# Altium schematic sheet Sheet1.SchDoc
size A4
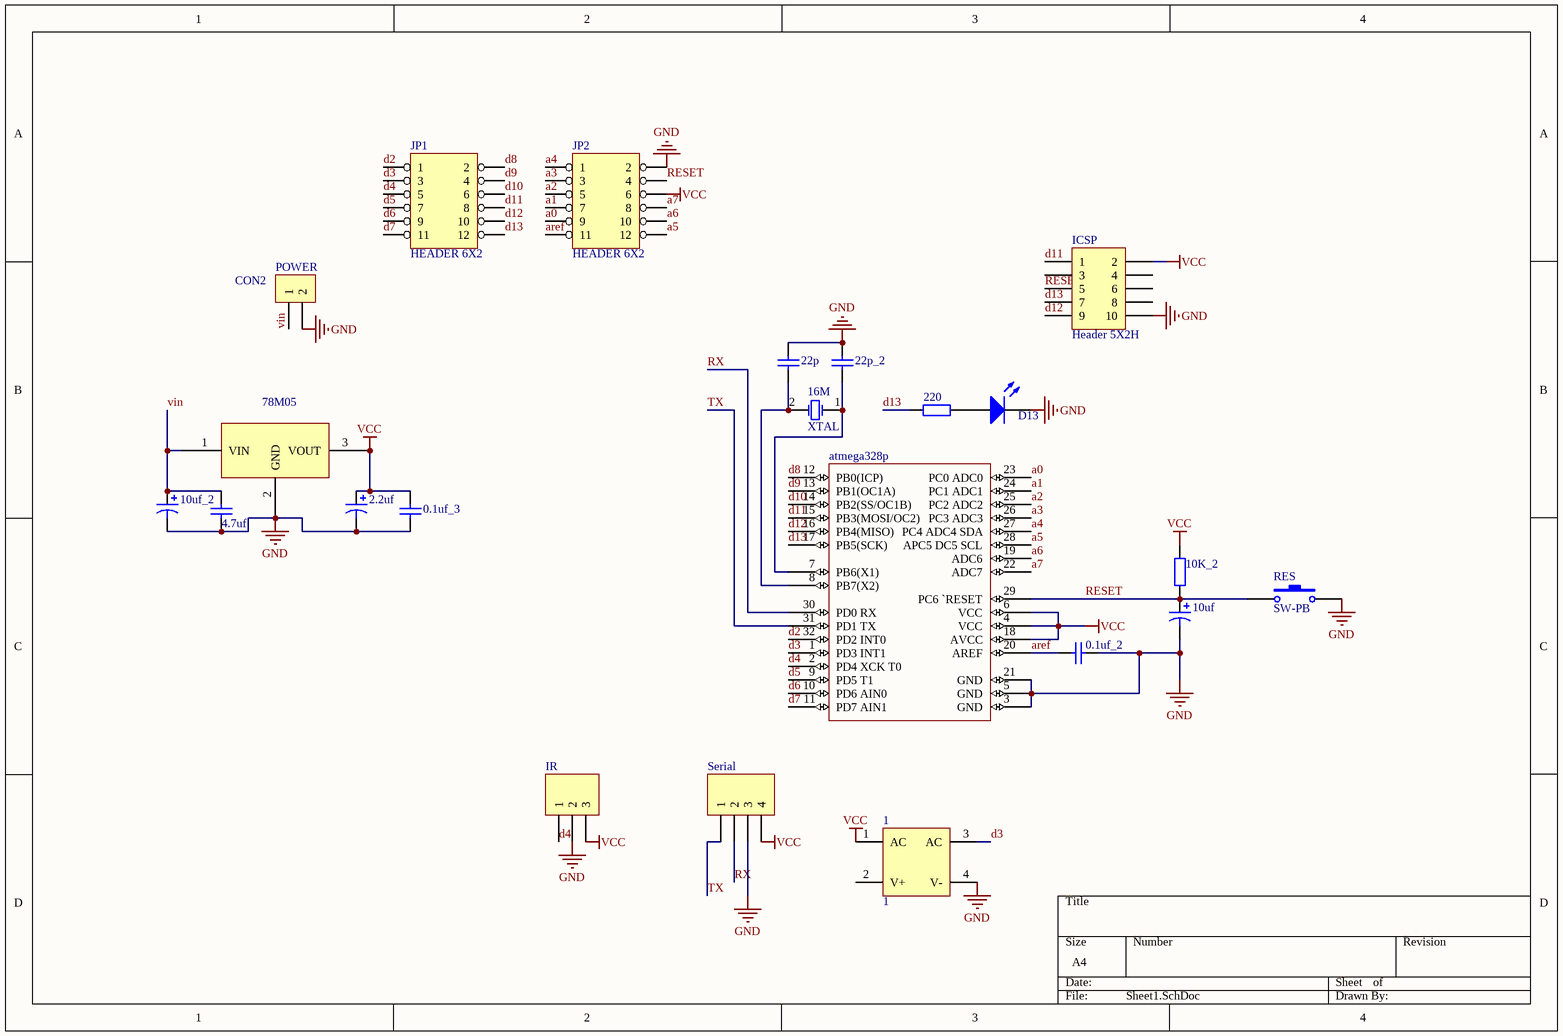
[diagram p0: Sheet1.SchDoc]

## Parts
0.1uf_2  Cap  [C-RAD-0805]  (value not drawn)
0.1uf_3  Cap  [C-RAD-0805]  (value not drawn)
1  1  [WS2812]
2.2uf  Cap Pol1  [C-RAD-0805]  (value not drawn)
4.7uf  Cap  [C-RAD-0805]  (value not drawn)
10K_2  Res2  [0805-2]  (value not drawn)
10uf  Cap Pol1  [C-RAD-0805]  (value not drawn)
10uf_2  Cap Pol1  [C-RAD-0805]  (value not drawn)
16M  XTAL  [XTAL2]
22p  Cap  [C-RAD-0805]  (value not drawn)
22p_2  Cap  [C-RAD-0805]  (value not drawn)
220  Res2  [0805-2]  (value not drawn)
?  78M05  [TO-252]
atmega328p  atmega328p  [32M1-A_M]  (value not drawn)
D13  LED0  [LED_0805]  (value not drawn)
ICSP  Header 5X2H  [HDR2X5H]
IR  Header 3  [HS0038B]  (value not drawn)
JP1  HEADER 6X2  [ssssop_12]
JP2  HEADER 6X2  [ssssop_12]
POWER  CON2  [PIN2]
RES  SW-PB  [SW_PB2_A1]
Serial  Header 4  [HDR1X4]  (value not drawn)

## Nets
GND: 0.1uf_2.1 0.1uf_3.2 1.4(V-) 2.2uf.2 4.7uf.2 10uf.2 10uf_2.2 22p.2 22p_2.2 ?.2(GND) atmega328p.3(GND) atmega328p.5(GND) atmega328p.21(GND) D13.2(K) ICSP.10 IR.2 JP2.2 POWER.2 RES.2 Serial.3
VCC: 0.1uf_3.1 1.1(AC) 2.2uf.1 10K_2.2 ?.3(VOUT) atmega328p.4(VCC) atmega328p.6(VCC) atmega328p.18(AVCC) ICSP.2 IR.3 JP2.6 Serial.4
a0: atmega328p.23(PC0_ADC0) JP2.9
a1: atmega328p.24(PC1_ADC1) JP2.7
a2: atmega328p.25(PC2_ADC2) JP2.5
a3: atmega328p.26(PC3_ADC3) JP2.3
a4: atmega328p.27(PC4_ADC4_SDA) JP2.1
a5: atmega328p.28(APC5_DC5_SCL) JP2.12
a6: atmega328p.19(ADC6) JP2.10
a7: atmega328p.22(ADC7) JP2.8
aref: 0.1uf_2.2 atmega328p.20(AREF) JP2.11
d2: atmega328p.32(PD2_INT0) JP1.1
d3: 1.3(AC) atmega328p.1(PD3_INT1) JP1.3
d4: atmega328p.2(PD4_XCK_T0) IR.1 JP1.5
d5: atmega328p.9(PD5_T1) JP1.7
d6: atmega328p.10(PD6_AIN0) JP1.9
d7: atmega328p.11(PD7_AIN1) JP1.11
d8: atmega328p.12(PB0(ICP)) JP1.2
d9: atmega328p.13(PB1(OC1A)) JP1.4
d10: atmega328p.14(PB2(SS/OC1B)) JP1.6
d11: atmega328p.15(PB3(MOSI/OC2)) ICSP.1 JP1.8
d12: atmega328p.16(PB4(MISO)) ICSP.9 JP1.10
d13: 220.2 atmega328p.17(PB5(SCK)) ICSP.7 JP1.12
RESET: 10K_2.1 10uf.1 atmega328p.29(PC6_`RESET) ICSP.5 JP2.4 RES.1
RX: atmega328p.30(PD0_RX) Serial.2
TX: atmega328p.31(PD1_TX) Serial.1
vin: 4.7uf.1 10uf_2.1 ?.1(VIN) POWER.1
Net16M_1: 16M.1 22p_2.1 atmega328p.7(PB6(X1))
Net16M_2: 16M.2 22p.1 atmega328p.8(PB7(X2))
Net220_1: 220.1 D13.1(A)

Not connected (* = marked no-connect by the designer): 1 2(V+); ICSP 3 4 6 8

## Library data of the parts
0.1uf_2 0.1uf_3 4.7uf = Cap: Capacitor; Value: 0.1uF; Published: 8-Jun-2000; LatestRevisionDate: 17-Jul-2002; LatestRevisionNote: Re-released for DXP Platform.; PackageReference: RAD-0.3; Publisher: Altium Limited; PackageDescription: Radial Cap, Thru-Hole; 2 Leads; 0.3 in Pin Spacing
1 = BRIDGE2: Diode Bridge; pin to pad: 3>4 4>3
2.2uf 10uf_2 = Cap Pol1: Polarized Capacitor (Radial); Value: 10uF; Published: 8-Jun-2000; LatestRevisionDate: 17-Jul-2002; LatestRevisionNote: Re-released for DXP Platform.; PackageReference: RB7.6-15; Publisher: Altium Limited; PackageDescription: Polarized Capacitor (Radial); 2 Leads
10K_2 220 = Res2: Resistor; Value: 10K; Published: 8-Jun-2000; LatestRevisionDate: 17-Jul-2002; LatestRevisionNote: Re-released for DXP Platform.; PackageReference: AXIAL-0.4; Publisher: Altium Limited; PackageDescription: Axial Device, Thru-Hole; 2 Leads; 0.4 in Pin Spacing
10uf = Cap Pol1: Polarized Capacitor (Radial); Value: 1uF; Published: 8-Jun-2000; LatestRevisionDate: 17-Jul-2002; LatestRevisionNote: Re-released for DXP Platform.; PackageReference: RB7.6-15; Publisher: Altium Limited; PackageDescription: Polarized Capacitor (Radial); 2 Leads
22p 22p_2 = Cap: Capacitor; Value: 0.01uF; Published: 8-Jun-2000; LatestRevisionDate: 17-Jul-2002; LatestRevisionNote: Re-released for DXP Platform.; PackageReference: RAD-0.3; Publisher: Altium Limited; PackageDescription: Radial Cap, Thru-Hole; 2 Leads; 0.3 in Pin Spacing
? = LM7805
D13 = LED0: 发光二极管; Published: 8-Jun-2000; LatestRevisionDate: 08-Jul-2005; LatestRevisionNote: Mech Layer 1 removed.; PackageReference: LED-0; Publisher: Altium Limited
ICSP = Header 5X2H: Header, 5-Pin, Dual row, Right Angle; LatestRevisionDate: 17-Jul-2002; LatestRevisionNote: Re-released for DXP Platform.; Publisher: Altium Limited
IR = Header 3: Header, 3-Pin; LatestRevisionDate: 17-Jul-2002; LatestRevisionNote: Re-released for DXP Platform.; Publisher: Altium Limited
POWER = CON2: Connector
RES = SW-PB: 微动开关; Published: 24-Mar-1999; LatestRevisionDate: 17-Jul-2002; LatestRevisionNote: Re-released for DXP Platform.; PackageReference: SPST-2; Publisher: Altium Limited
Serial = Header 4: Header, 4-Pin; LatestRevisionDate: 17-Jul-2002; LatestRevisionNote: Re-released for DXP Platform.; Publisher: Altium Limited